# Altium schematic sheet VER1.3.SchDoc
size A3
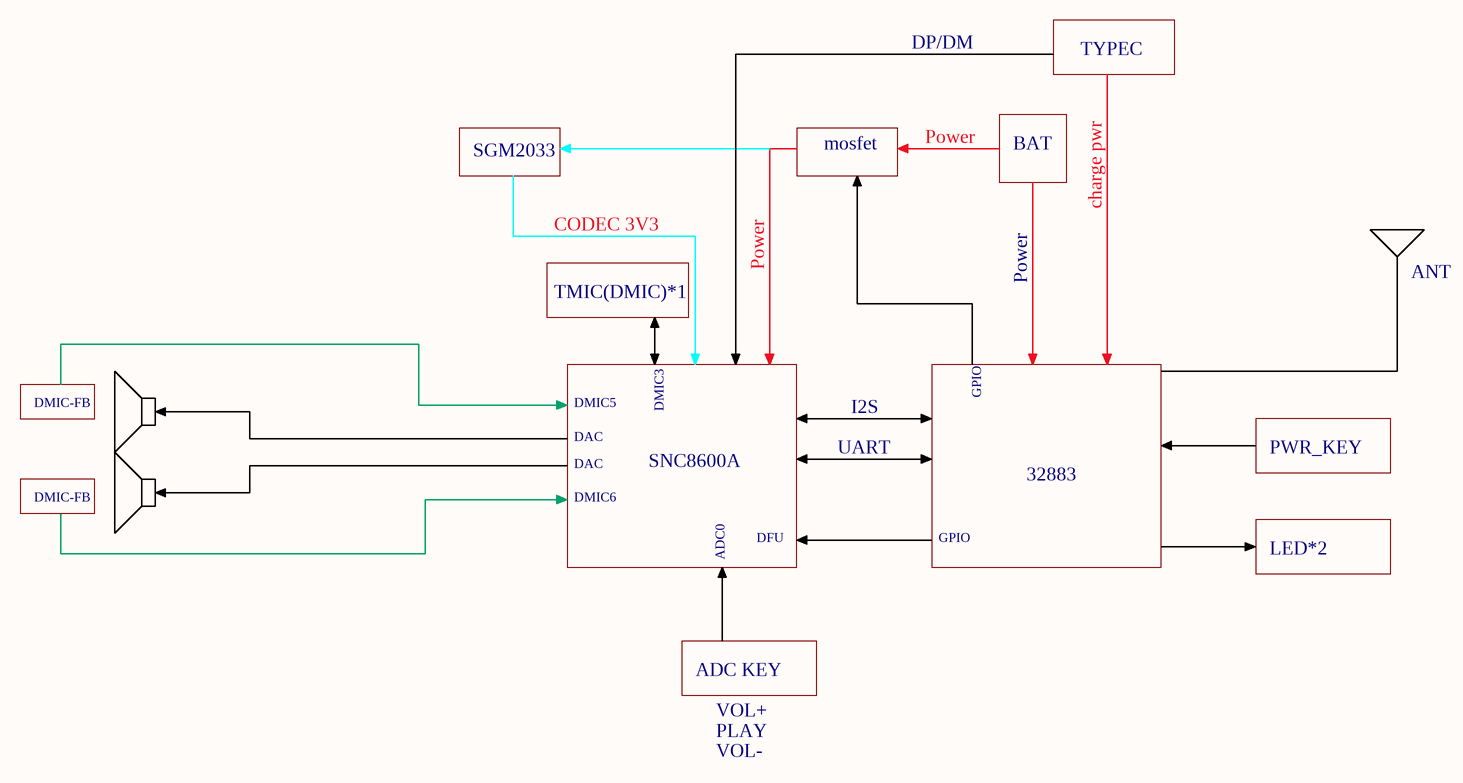
[diagram p0: VER1.3.SchDoc]

## Notes on the sheet
- DP/DM
- TYPEC
- SGM2033
- mosfet
- Power
- BAT
- CODEC 3V3
- charge pwr
- TMIC(DMIC)*1
- ANT
- DMIC-FB
- DAC
- DMIC5
- DMIC3
- UART
- I2S
- GPIO
- PWR_KEY
- DMIC6
- SNC8600A
- 32883
- ADC0
- DFU
- LED*2
- ADC KEY
- VOL+
- PLAY
- VOL-